# EasyEDA Pro project compute-module-v101.eprj, board base-board-6x
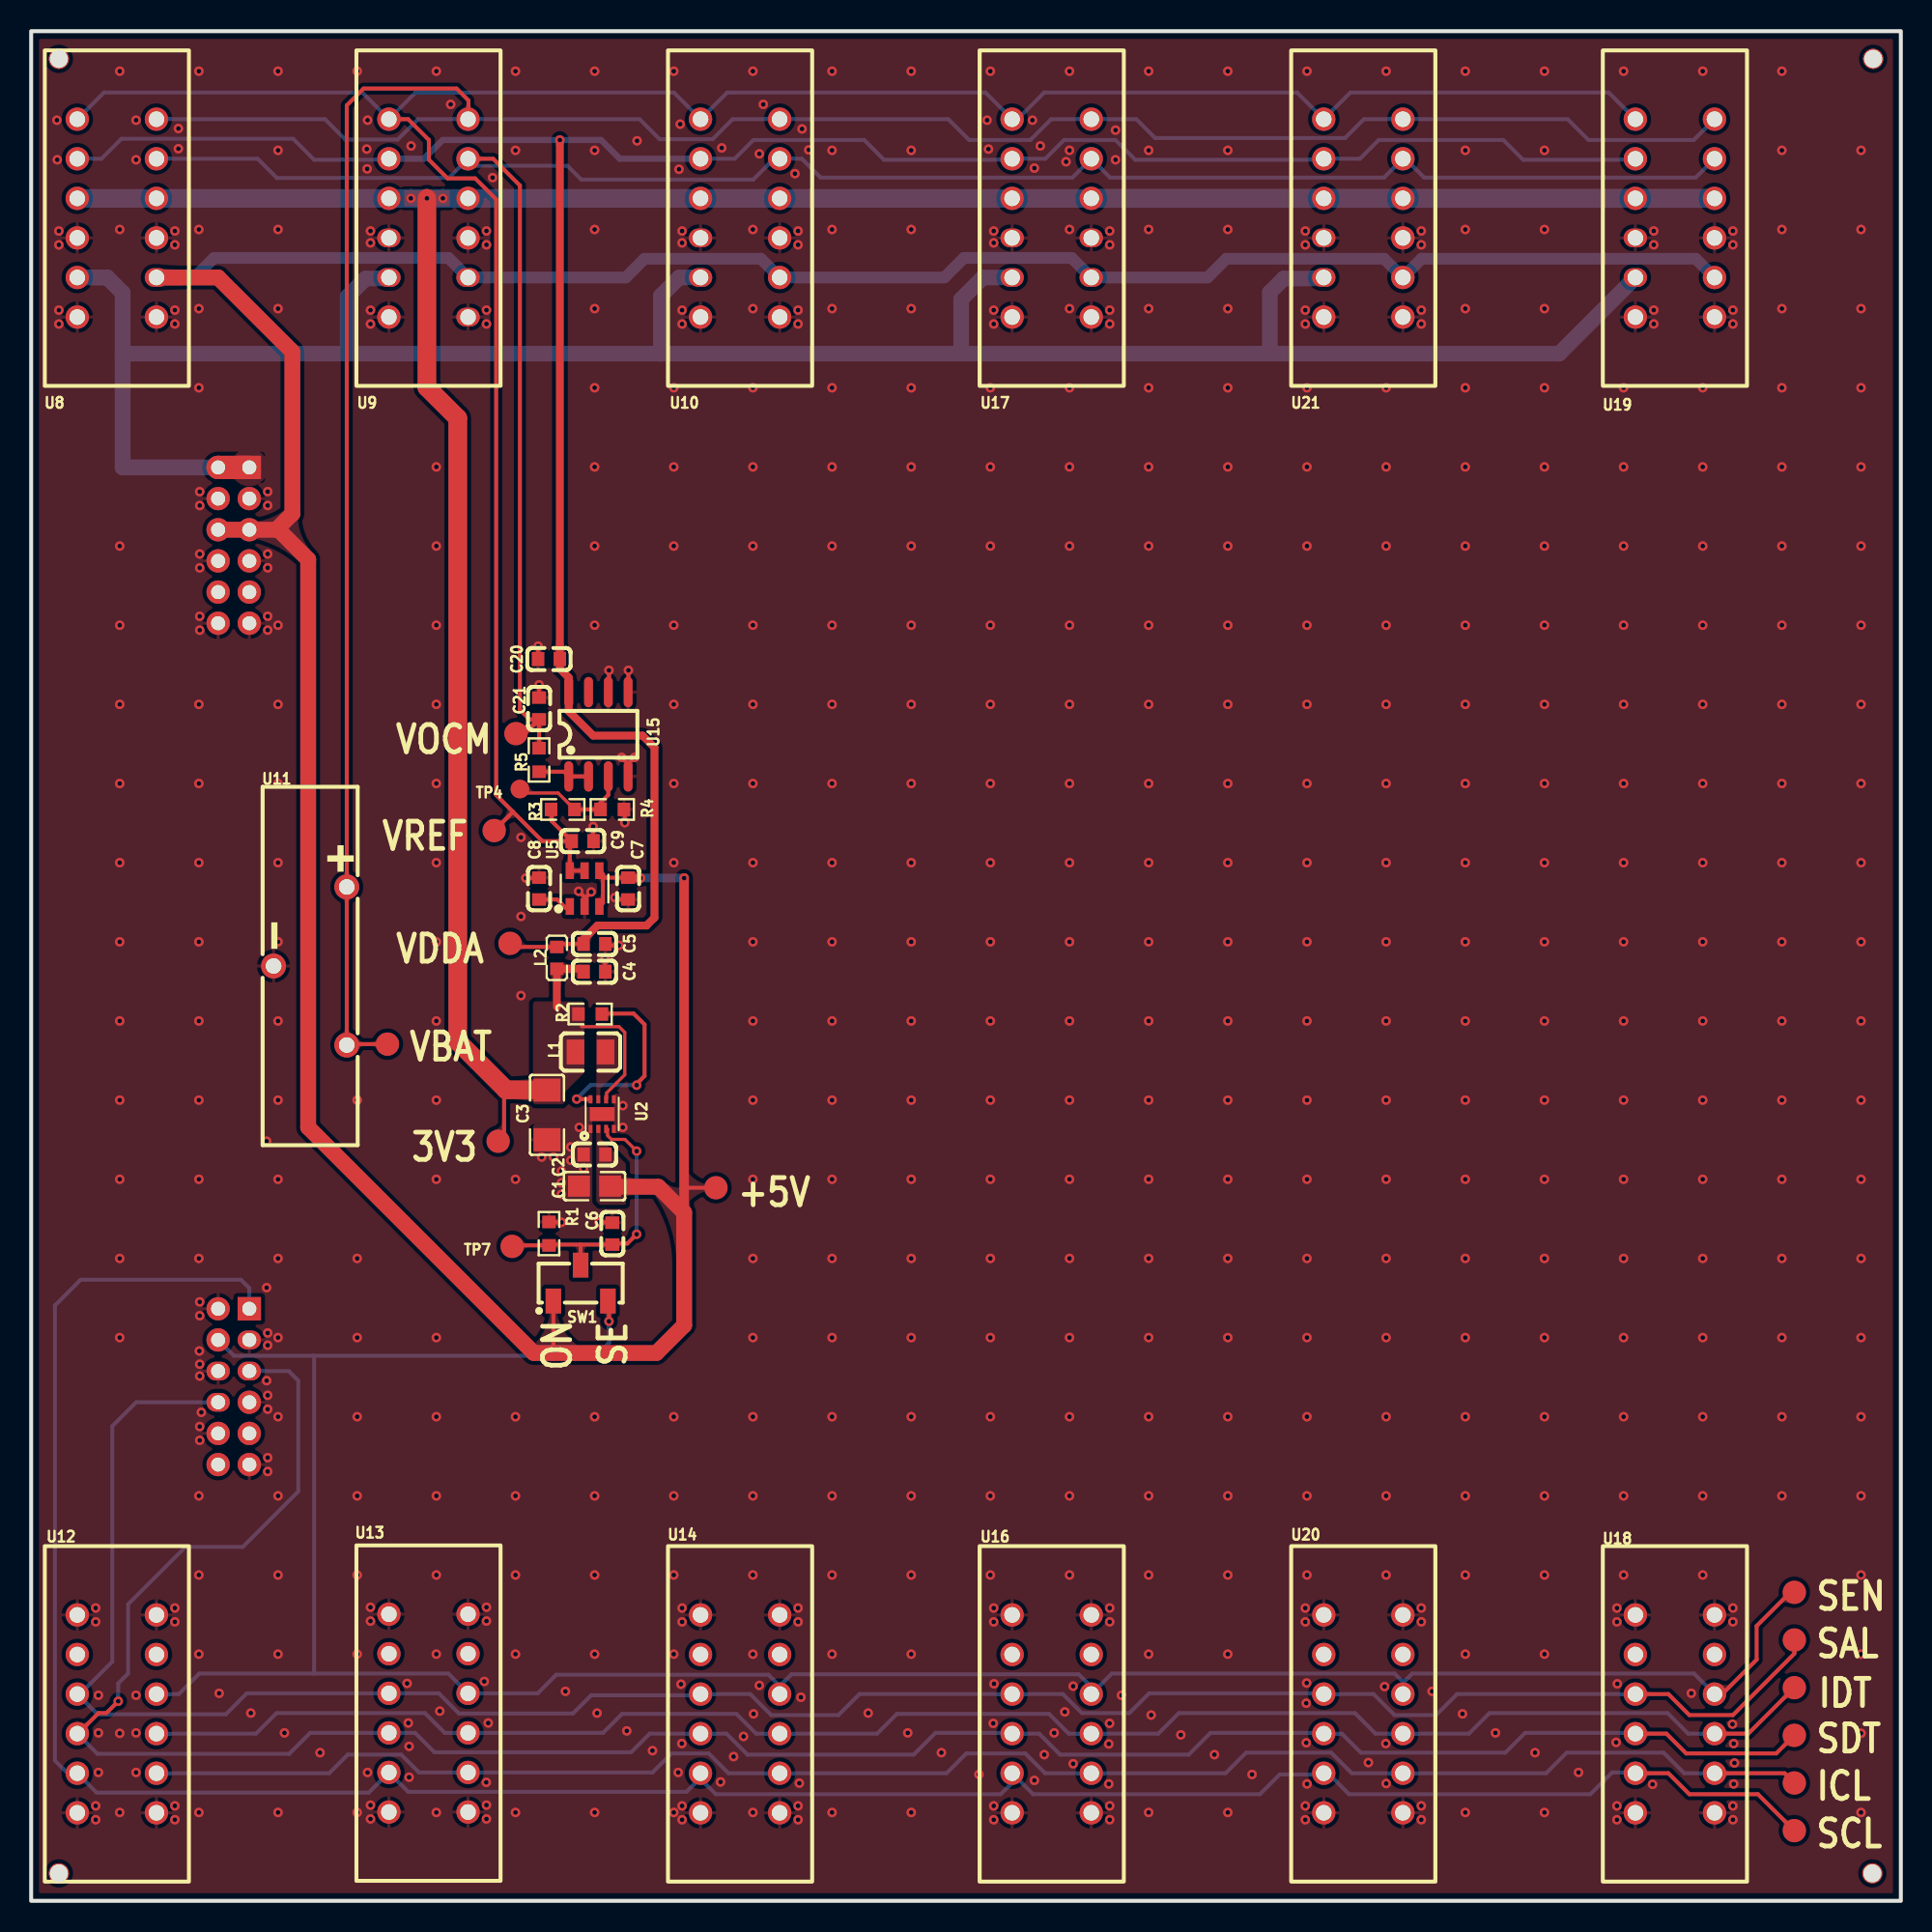
[diagram p16: board, top side]
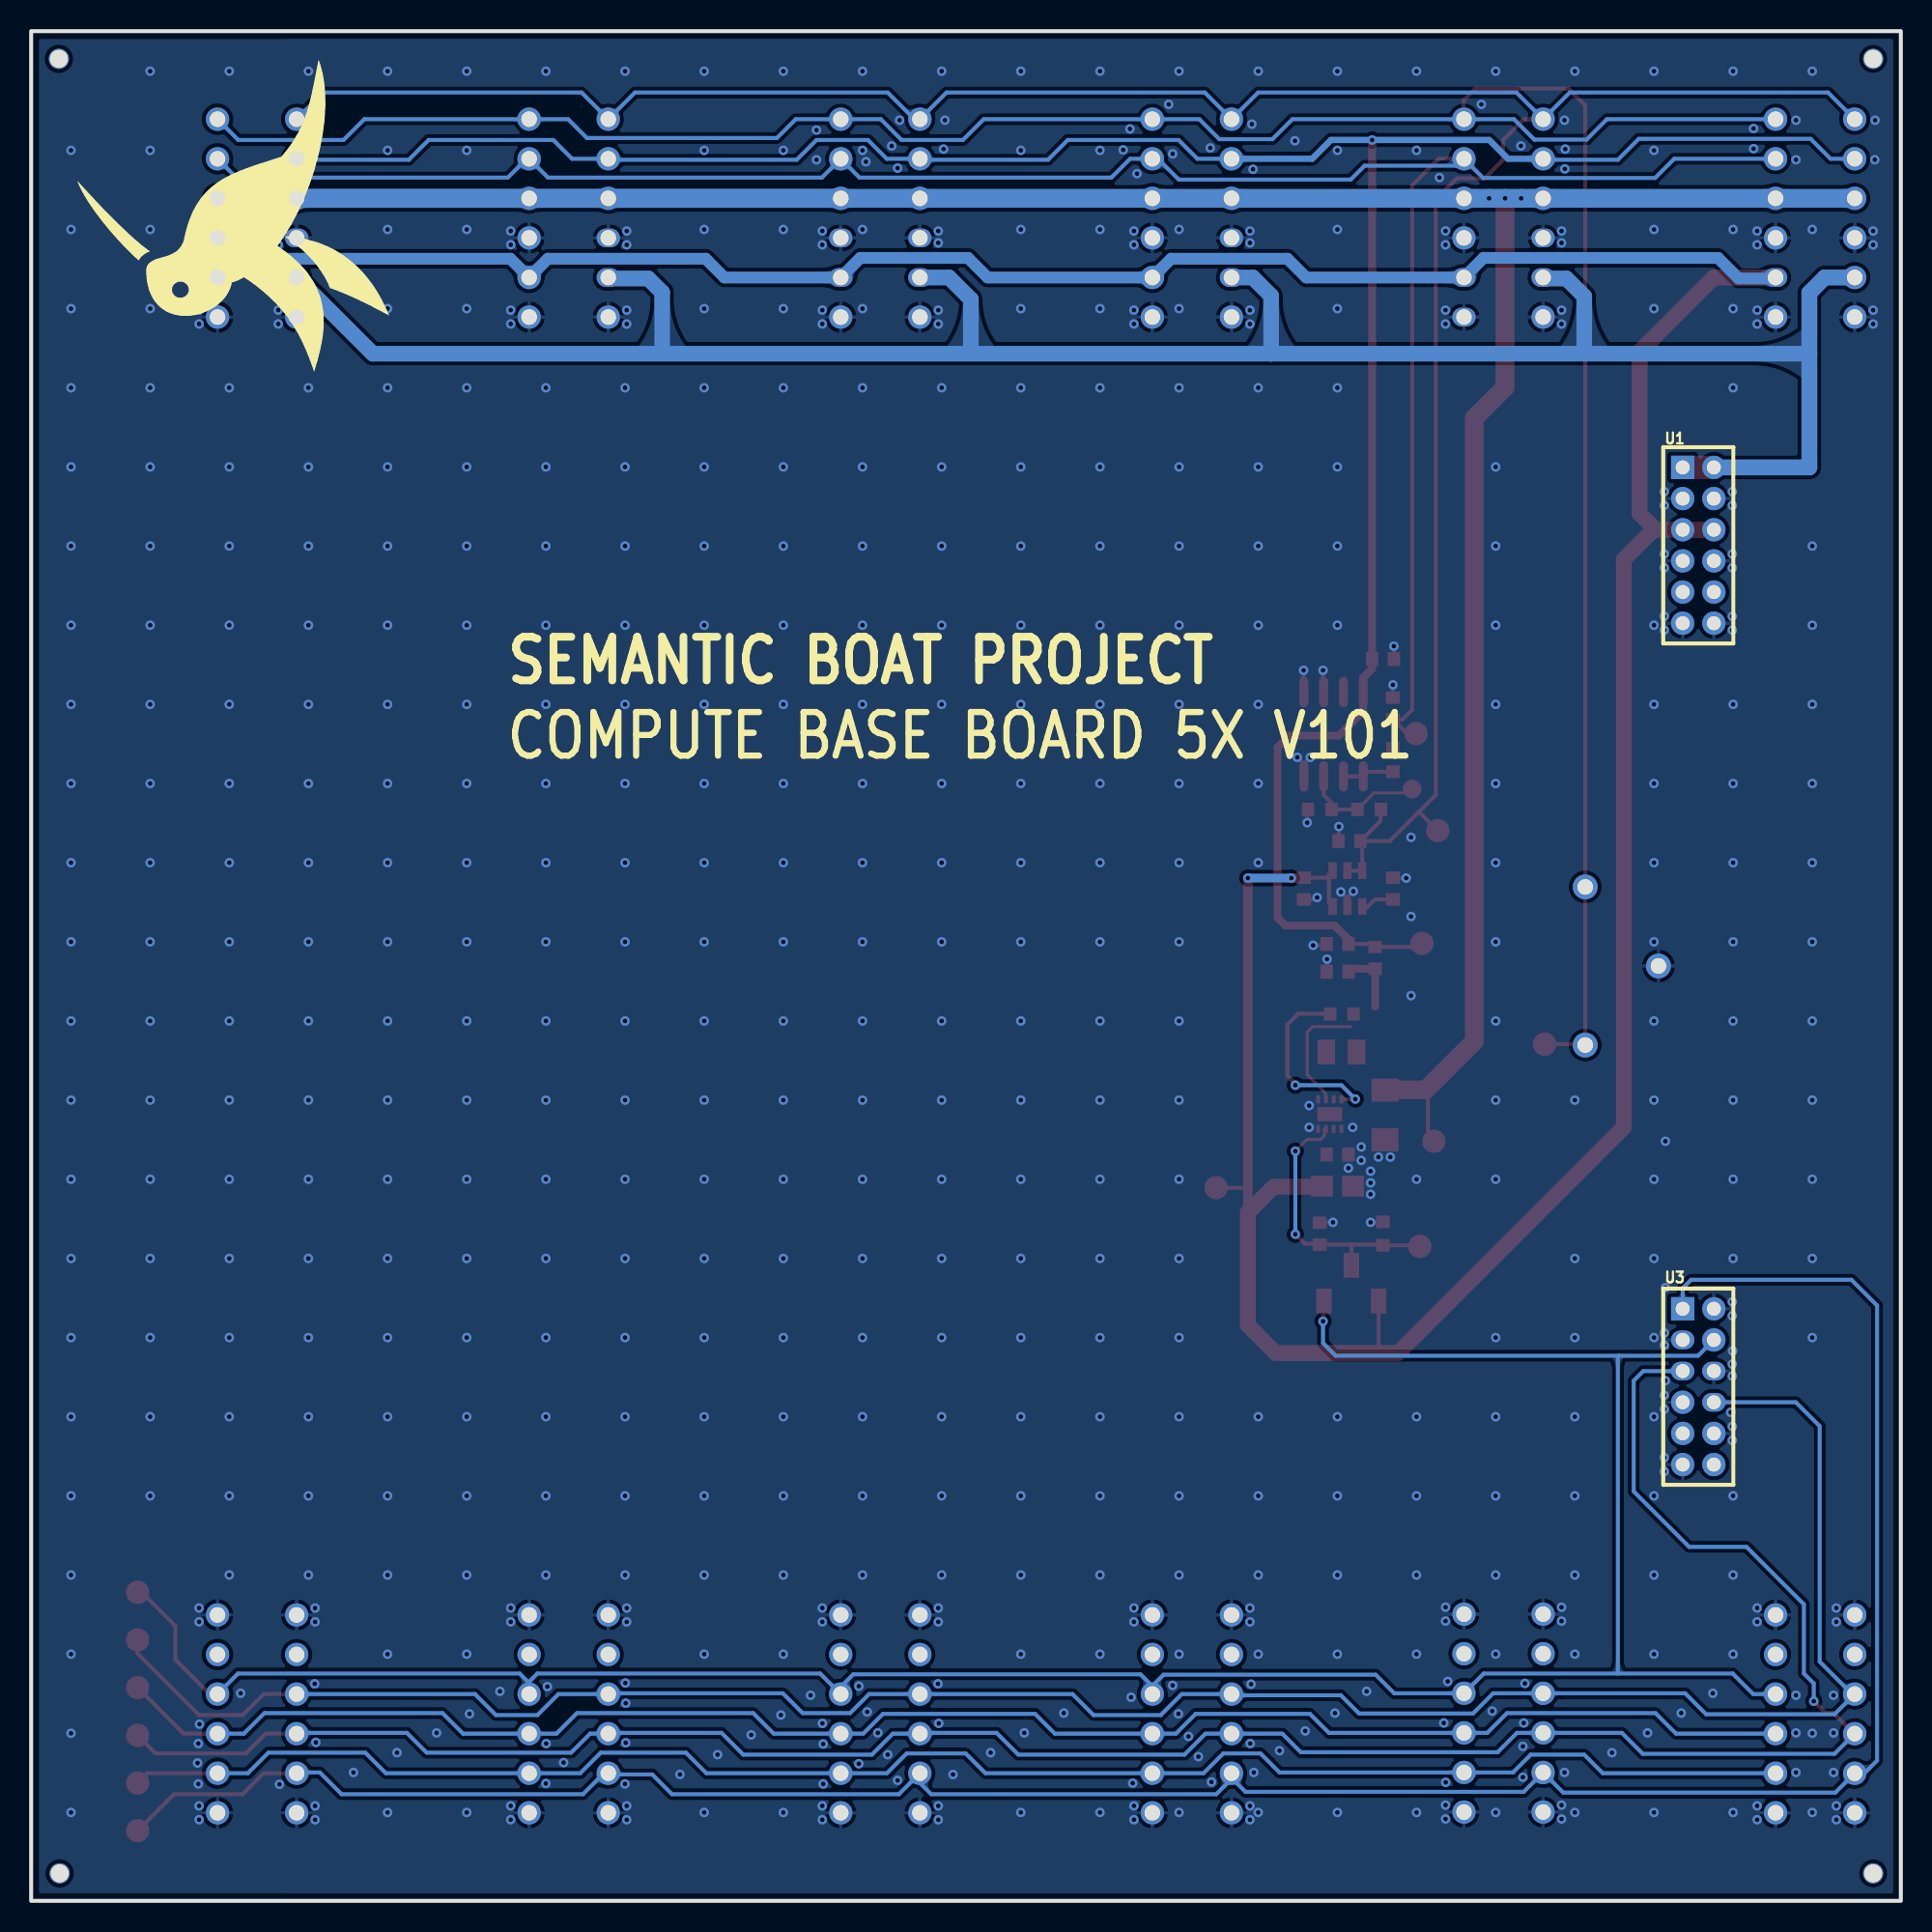
[diagram p17: board, bottom side, seen from below]

Outline 120 x 120 mm; copper layers: Top Layer, Inner1, Inner2, Bottom Layer. Coordinates in mm from the lower left corner of the outline.
Outline path: rectangle 0,120 120,0
Stack: Top Layer 0.035mm Outer layer thickness 1oz / Dielectric1 0.2104mm 7628 RC49% 8.6mil / Inner1 0.0152mm Inner layer thickness / Dielectric2 1.065mm 1.1mm H/HOZ Copper / Inner2 0.0152mm Inner layer thickness / Dielectric3 0.2104mm 7628 RC49% 8.6mil / Bottom Layer 0.035mm Outer layer thickness 1oz

## Design rules (mm)
template: JLCPCB Capability(Two Layers Board)
spacing copperThickness1oz (default): track to track 0.102, other pairs 0.152 to 0.3
spacing copperThickness2oz: track to track 0.203, other pairs 0.152 to 0.3
track width copperThickness1oz (default): min 0.127, default 0.254, max 2.54
track width copperThickness2oz: min 0.203, default 0.254, max 2.54
differential pair differentialPair (default): width min 0.127, default 0.254, max 2.54; gap min 0.152, default 0.152
via viaSize (default): diameter min 0.5, default 0.61, max 10; hole min 0.3, default 0.305, max 6.3

## Placement (name value [footprint] x y rotation side)
C1  10uF  [C0805]  36.16 45.87 180 top
C2  100nF  [C0603]  36.16 47.9 180 top
C3  22uF  [C1206]  33.11 50.44 270 top
C4  100nF  [C0603]  36.15 59.63 180 top
C5  100nF  [C0603]  36.15 61.41 180 top
C6  100nF  [C0603]  37.3 42.82 90 top
C7  100nF  [C0603]  38.31 64.97 270 top
C8  100nF  [C0603]  32.6 64.97 90 top
C9  100nF  [C0603]  35.39 68.02 0 top
C20  100nF  [C0603]  33.23 79.7 180 top
C21  2.2uF  [C0603]  32.6 76.53 90 top
L1  2.2uH  [IND-SMD_L2.0-W1.6-1]  35.9 54.48 180 top
L2  BLM18KG601SN1D  [L0603]  33.74 60.52 90 top
NOREF  -  [Pad_e13857]  118.17 1.76 90 top
NOREF#2  -  [Pad_e13859]  1.78 118.22 270 top
NOREF#3  -  [Pad_e13856]  1.78 1.76 0 top
NOREF#4  -  [Pad_e13858]  118.22 118.22 180 top
R1  100kΩ  [R0603]  33.24 42.82 90 top
R2  100kΩ  [R0603]  35.88 56.92 180 top
R3  10kΩ  [R0603]  34.12 70.05 0 top
R4  10kΩ  [R0603]  37.3 70.05 0 top
R5  10Ω  [R0603]  32.6 73.22 90 top
SW1  CAS-120A  [SW-SMD_CAS-120A]  35.27 39.65 0 top
TP1  -  [Test-Point-0.5mm]  29.72 68.69 0 top
TP2  -  [Test-Point-0.5mm]  43.95 45.77 0 top
TP3  -  [Test-Point-0.5mm]  31.11 74.92 0 top
TP4  -  [Test-Point-0.5mm#2]  31.37 71.36 0 top
TP5  -  [Test-Point-0.5mm]  29.97 48.75 0 top
TP6  -  [Test-Point-0.5mm]  30.73 61.45 0 top
TP7  -  [Test-Point-0.5mm]  30.87 42 0 top
TP8  -  [Test-Point-0.5mm]  113.17 19.8 0 top
TP9  -  [Test-Point-0.5mm]  113.17 16.74 0 top
TP10  -  [Test-Point-0.5mm]  113.17 4.5 0 top
TP11  -  [Test-Point-0.5mm]  113.17 10.62 0 top
TP13  -  [Test-Point-0.5mm]  22.87 54.99 0 top
TP14  -  [Test-Point-0.5mm]  113.17 7.56 0 top
TP15  -  [Test-Point-0.5mm]  113.17 13.68 0 top
U1  2005FV-2x6P  [HDR-TH_12P-P2.00-V-F-R2-C6-S2.00]  13 87 270 bottom
U2  TPS62162DSGR  [WSON-8_L2.0-W2.0-P0.50-TL-EP]  36.65 50.49 90 top
U3  2005FV-2x6P  [HDR-TH_12P-P2.00-V-F-R2-C6-S2.00#2]  13 33 270 bottom
U5  ZJR1001-3BUTBR  [SOT-23-6_L2.9-W1.6-P0.95-LS2.9-BL]  35.52 64.97 0 top
U8  ED12BGFBK  [CONN-TH_12P-P2.54_WINGTAT_ED12BGFBK#2]  5.5 108 90 top
U9  ED12BGFBK  [CONN-TH_12P-P2.54_WINGTAT_ED12BGFBK#3]  25.5 108 90 top
U10  ED12BGFBK  [CONN-TH_12P-P2.54_WINGTAT_ED12BGFBK#4]  45.5 108 90 top
U11  VBH2032-1  [BAT-TH_3P-L23.0-W6.0_VBH2032-1]  17.91 60 270 top
U12  ED12BGFBK  [CONN-TH_12P-P2.54_WINGTAT_ED12BGFBK#5]  5.5 12 90 top
U13  ED12BGFBK  [CONN-TH_12P-P2.54_WINGTAT_ED12BGFBK#5]  25.5 12.05 90 top
U14  ED12BGFBK  [CONN-TH_12P-P2.54_WINGTAT_ED12BGFBK#5]  45.5 12 90 top
U15  TLV9062IDR  [SOIC-8_L5.0-W4.0-P1.27-LS6.0-BL]  36.41 74.87 0 top
U16  ED12BGFBK  [CONN-TH_12P-P2.54_WINGTAT_ED12BGFBK#5]  65.5 12 90 top
U17  ED12BGFBK  [CONN-TH_12P-P2.54_WINGTAT_ED12BGFBK]  65.5 108 90 top
U18  ED12BGFBK  [CONN-TH_12P-P2.54_WINGTAT_ED12BGFBK#5]  105.5 12 90 top
U19  ED12BGFBK  [CONN-TH_12P-P2.54_WINGTAT_ED12BGFBK#4]  105.5 108 90 top
U20  ED12BGFBK  [CONN-TH_12P-P2.54_WINGTAT_ED12BGFBK#5]  85.5 12 90 top
U21  ED12BGFBK  [CONN-TH_12P-P2.54_WINGTAT_ED12BGFBK#4]  85.5 108 90 top

## Footprints (pads in the part's own frame, mm; a bottom-side part is the same pattern mirrored in y, then rotated)
BAT-TH_3P-L23.0-W6.0_VBH2032-1
  round 1.6 hole 1: 1(-5.075,2.35) 2(5.075,2.35) 3(0,-2.35)
C0603
  rect 0.8x0.9 smd: 1(-0.7,0) 2(0.7,0)
C0805
  rect 1.41x1.35 smd: 1(-1,0) 2(1,0)
C1206
  rect 1.485x1.728 smd: 1(-1.593,0) 2(1.593,0)
CONN-TH_12P-P2.54_WINGTAT_ED12BGFBK
  round 1.5 hole 1: 1(-6.35,2.54) 4(1.27,2.54) 5(3.81,2.54) 6(6.35,2.54) 7(6.35,-2.54) 8(3.81,-2.54) 9(1.27,-2.54) 12(-6.35,-2.54)
  oval 1.2x1.5 hole 1: 2(-3.81,2.54) 3(-1.27,2.54) 10(-1.27,-2.54) 11(-3.81,-2.54)
CONN-TH_12P-P2.54_WINGTAT_ED12BGFBK#2
  round 1.5 hole 1: 1(-6.35,2.54) 2(-3.81,2.54) 3(-1.27,2.54) 4(1.27,2.54) 5(3.81,2.54) 6(6.35,2.54) 7(6.35,-2.54) 8(3.81,-2.54) 9(1.27,-2.54) 10(-1.27,-2.54) 12(-6.35,-2.54)
  oval 1.2x1.5 hole 1: 11(-3.81,-2.54)
CONN-TH_12P-P2.54_WINGTAT_ED12BGFBK#3
  round 1.5 hole 1: 1(-6.35,2.54) 4(1.27,2.54) 5(3.81,2.54) 6(6.35,2.54) 7(6.35,-2.54) 8(3.81,-2.54) 9(1.27,-2.54) 10(-1.27,-2.54)
  oval 1.2x1.5 hole 1: 2(-3.81,2.54) 3(-1.27,2.54) 11(-3.81,-2.54) 12(-6.35,-2.54)
CONN-TH_12P-P2.54_WINGTAT_ED12BGFBK#4
  round 1.5 hole 1: 1(-6.35,2.54) 4(1.27,2.54) 5(3.81,2.54) 6(6.35,2.54) 7(6.35,-2.54) 8(3.81,-2.54) 9(1.27,-2.54) 10(-1.27,-2.54) 11(-3.81,-2.54) 12(-6.35,-2.54)
  oval 1.2x1.5 hole 1: 2(-3.81,2.54) 3(-1.27,2.54)
CONN-TH_12P-P2.54_WINGTAT_ED12BGFBK#5
  round 1.5 hole 1: 1(-6.35,2.54) 2(-3.81,2.54) 3(-1.27,2.54) 4(1.27,2.54) 5(3.81,2.54) 6(6.35,2.54) 7(6.35,-2.54) 8(3.81,-2.54) 9(1.27,-2.54) 10(-1.27,-2.54) 11(-3.81,-2.54) 12(-6.35,-2.54)
HDR-TH_12P-P2.00-V-F-R2-C6-S2.00
  rect 1.5x1.5 hole 0.9: 1(-5,-1)
  round 1.5 hole 0.9: 2(-5,1) 3(-3,-1) 4(-3,1) 5(-1,-1) 6(-1,1) 7(1,-1) 8(1,1) 9(3,-1) 10(3,1) 11(5,-1) 12(5,1)
HDR-TH_12P-P2.00-V-F-R2-C6-S2.00#2
  rect 1.5x1.5 hole 0.9: 1(-5,-1)
  round 1.5 hole 0.9: 2(-5,1) 4(-3,1) 7(1,-1) 9(3,-1) 10(3,1) 11(5,-1) 12(5,1)
  oval 1.2x1.5 hole 0.9: 3(-3,-1) 5(-1,-1) 6(-1,1) 8(1,1)
IND-SMD_L2.0-W1.6-1
  rect 1.133x1.6 smd: 1(-0.967,0) 2(0.967,0)
L0603
  rect 0.8x0.864 smd: 1(-0.7,0) 2(0.7,0)
Pad_e13856
  round 1.3 hole 1.152: 1(0,0)
Pad_e13857
  round 1.3 hole 1.152: 1(0,0)
Pad_e13858
  round 1.3 hole 1.152: 1(0,0)
Pad_e13859
  round 1.3 hole 1.152: 1(0,0)
R0603
  rect 0.806x0.864 smd: 1(-0.753,0) 2(0.753,0)
SOIC-8_L5.0-W4.0-P1.27-LS6.0-BL
  oval 0.569x1.95 smd: 1(-1.905,-2.705) 2(-0.635,-2.705) 3(0.635,-2.705) 4(1.905,-2.705) 5(1.905,2.705) 6(0.635,2.705) 7(-0.635,2.705) 8(-1.905,2.705)
SOT-23-6_L2.9-W1.6-P0.95-LS2.9-BL
  rect 0.532x1.072 smd: 1(-0.95,-1.149) 2(0,-1.149) 3(0.95,-1.149) 4(0.95,1.149) 5(0,1.149) 6(-0.95,1.149)
SW-SMD_CAS-120A
  rect 1x1.6 smd: 1(-1.75,-1.15) 2(0,1.15) 3(1.75,-1.15)
Test-Point-0.5mm
  round 1.5 smd: 1(0,0)
Test-Point-0.5mm#2
  round 1.2 smd: 1(0,0)
WSON-8_L2.0-W2.0-P0.50-TL-EP
  rect 0.521x0.25 smd: 1(-0.95,0.75) 2(-0.95,0.25) 3(-0.95,-0.25) 4(-0.95,-0.75) 5(0.95,-0.75) 6(0.95,-0.25) 7(0.95,0.25) 8(0.95,0.75)
  rect 0.9x1.6 smd: 9(0,0)

## Nets
As in the schematic.

Pads without a net: NOREF 1; NOREF#2 1; NOREF#3 1; NOREF#4 1; U1 9 10; U3 9 12; U12 5 8; U13 5 8; U14 5 8; U15 7; U16 5 8; U18 5 8; U20 5 8

## Via types
v1: diameter 0.61, hole 0.305, Top Layer to Bottom Layer, 679 vias

## Routing (per net, layer and track width the routed paths; a pad name or vN(x,y) marks a point on that pad's centre or on a via; arc(x,y) is an arc through that point)
+3V3: length 182.2
  Top Layer w0.2: U2.6 36.9,51.49 36.93,51.52 36.93,51.85 37.55,52.47 37.55,52.47 38.1,53.02 38.1,55.74 37.73,56.11 35.32,56.11
  Top Layer w0.254: TP5.1 30.35,49.13 30.35,51.8
  Top Layer w0.5: C4.2 35.27,59.82 L2.1 33.74,57.39
  Top Layer w1.2: v1(25.4,109.27) 25.4,97.14 27.38,95.16 27.38,55.16 30.48,52.06 33.09,52.06 C3.1
  Bottom Layer w1.2: U17.9 U17.4 U10.9 U10.4 U9.9 v1(26.43,109.27) v1(25.4,109.27) v1(24.37,109.27) U9.4 U8.9 U8.4
  Bottom Layer w1.219: U19.9 U19.4 U21.9 U21.4 U17.9
+5V: length 248.8
  Top Layer w0.254: 36.47,66.12 36.7,65.88 36.7,65.64 ; 36.47,63.82 36.7,64.05 36.7,65.64 ; SW1.1 33.52,35.18 33.5,35.16 ; 36.7,65.64 36.73,65.67 C7.1 ; 41.78,45.7 41.85,45.77 TP2.1
  Top Layer w0.559: v1(39.12,65.64) 38.34,65.64 C7.1
  Top Layer w0.61: v1(41.91,65.64) 41.91,44.17
  Top Layer w1.016: U8.11 12,104.19 16.76,99.43 16.76,89.03 15.73,88 U1.5 U1.6 ; C1.1 37.2,45.83 40.25,45.83 41.91,44.17 41.91,36.94 40.13,35.16 32.26,35.16 17.78,49.64 17.78,86.09 15.88,88
  Bottom Layer w0.559: v1(41.91,65.64) v1(39.12,65.64)
  Bottom Layer w0.75: U19.11 106.84,105.39 89.25,105.39 U21.11 86.84,105.39 76.71,105.39 75.5,104.19 U17.11 66.78,105.45 59.87,105.45 58.61,104.19 U10.11 46.84,105.39 39.37,105.39 38.16,104.19 U9.11 26.78,105.45 11.73,105.45 10.41,104.12 8.11,104.12 U8.11
+12V: length 150.2
  Top Layer w1.5: U1.2 U1.1
  Bottom Layer w1: 59.69,99.43 59.69,102.79 61.09,104.19 U17.2 ; 20.32,99.3 40.42,99.3 ; 20.32,99.3 5.9,99.3 5.87,99.27 ; 20.32,99.3 20.32,102.98 21.46,104.12 22.89,104.12 U9.2 ; 40.42,99.3 40.42,99.3 40.42,103.01 41.59,104.19 U10.2 ; 40.42,99.3 98.07,99.3 U19.2 ; U21.2 82.9,104.12 80.39,104.12 79.5,103.24 79.5,99.43
  Bottom Layer w1.016: U1.2 5.87,92 5.87,103.21 4.89,104.19 U8.2
GND: length 15.2
  Top Layer w0.254: R4.2 38.1,70 v1(38.1,69.2) ; R1.2 33.27,43.55 v1(34.04,43.55) ; 38.31,72.97 U15.4 ; 38.31,72.97 v1(38.74,73.39) ; 38.31,72.97 38.31,72.97 v1(37.9,73.39) ; 35.52,64.33 U5.2 ; 35.52,64.33 v1(35.94,64.75) ; 35.52,64.33 35.52,64.42 v1(35.14,64.8) ; v1(32.54,80.53) 32.54,79.7 C20.2 ; v1(36.07,68.95) 36.07,68.04 C9.2 ; C7.2 37.59,64.27 v1(37.47,64.39) ; v1(37.72,61.33) 36.94,61.33 C5.1 ; U15.6 37.08,77.62 v1(37.08,78.98) ; v1(31.75,65.64) 32.57,65.64 C8.2 ; v1(36.83,60.44) 36.83,59.66 C4.1 ; v1(32.6,78.05) 32.6,77.22 ; v1(36.45,43.55) 37.28,43.55 C6.2 ; U15.5 38.33,77.6 v1(38.33,78.98)
  vias: v1(1.65,114.28) v1(1.68,111.75) v1(1.78,107.17) v1(1.78,106.28) v1(1.78,102.09) v1(1.78,101.2) v1(4.14,18.8) v1(4.14,17.91) v1(4.14,6.1) v1(4.14,5.21) v1(4.32,13.19) v1(4.32,10.78) v1(4.32,8.24) v1(5.68,117.43) v1(5.68,107.27) v1(5.68,86.95) v1(5.68,81.87) v1(5.68,76.79) v1(5.68,71.71) v1(5.68,66.63) v1(5.68,61.55) v1(5.68,56.47) v1(5.68,51.39) v1(5.68,46.31) v1(5.68,41.23) v1(5.68,36.15) v1(5.68,10.75) v1(5.68,5.67) v1(6.73,114.28) v1(6.73,111.75) v1(6.73,13.19) v1(6.73,10.78) v1(6.73,8.24) v1(9.22,107.18) v1(9.22,106.29) v1(9.22,102.1) v1(9.22,101.21) v1(9.22,18.8) v1(9.22,17.91) v1(9.22,6.1) v1(9.22,5.21) v1(9.45,113.75) v1(9.45,112.46) v1(10.76,117.43) v1(10.76,107.27) v1(10.76,102.19) v1(10.76,97.11) v1(10.82,90.44) v1(10.82,89.55) v1(10.82,86.44) v1(10.82,85.55) v1(10.82,82.44) v1(10.82,81.55) v1(10.76,76.79) v1(10.76,71.71) v1(10.76,66.63) v1(10.76,61.55) v1(10.76,56.47) v1(10.76,51.39) v1(10.76,46.31) v1(10.76,41.23) v1(10.82,38.44) v1(10.82,37.55) v1(10.8,35.29) v1(10.82,34.44) v1(10.82,33.68) v1(10.82,30.44) v1(10.82,29.55) v1(10.76,25.99) v1(10.76,20.91) v1(10.76,15.83) v1(10.76,5.67) v1(10.92,31.35) v1(12.06,13.32) v1(14.1,12.05) v1(15.11,48.75) v1(15.11,39.35) v1(15.11,33.39) v1(15.18,90.45) v1(15.18,89.56) v1(15.18,86.45) v1(15.18,85.56) v1(15.18,82.45) v1(15.18,81.56) v1(15.18,36.45) v1(15.18,35.66) v1(15.18,32.45) v1(15.18,31.56) v1(15.18,28.45) v1(15.18,27.56) v1(15.84,117.43) v1(15.84,112.35) v1(15.84,107.27) v1(15.84,102.19) v1(15.84,81.87) v1(15.84,76.79) v1(15.84,71.71) v1(15.84,66.63) v1(15.84,61.55) v1(15.84,56.47) v1(15.84,51.39) v1(15.84,46.31) v1(15.84,41.23) v1(15.84,36.15) v1(15.84,31.07) v1(15.84,25.99) v1(15.84,20.91) v1(15.84,15.83) v1(15.84,5.67) v1(16.26,10.78) v1(18.54,9.51) v1(20.92,117.43) v1(20.92,51.39) v1(20.92,41.23) v1(20.92,36.15) v1(20.92,31.07) v1(20.92,25.99) v1(20.92,20.91) v1(20.92,15.83) v1(20.92,5.67) v1(21.54,112.43) v1(21.59,114.28) v1(21.56,111.16) v1(21.59,8.24) v1(21.78,107.17) v1(21.78,106.41) v1(21.78,102.09) v1(21.78,101.2) v1(21.78,18.84) v1(21.78,17.95) v1(21.78,6.14) v1(21.78,5.25) v1(24.13,13.96) v1(24.21,11.41) v1(24.26,9.92) v1(24.26,7.94) v1(24.38,112.63) v1(26,117.43) v1(26,92.03) v1(26,86.95) v1(26,81.87) v1(26,76.79) v1(26,71.71) v1(26,66.63) v1(26,61.55) v1(26,56.47) v1(26,51.39) v1(26,46.31) v1(26,36.15) v1(26,31.07) v1(26,25.99) v1(26,20.91) v1(26,15.83) v1(26,5.67) v1(26.23,12.18) v1(26.92,115.3) v1(29.08,14.08) v1(29.22,107.18) v1(29.22,106.29) v1(29.22,102.1) v1(29.22,101.21) v1(29.22,18.85) v1(29.22,17.96) v1(29.21,7.6) v1(29.22,6.15) v1(29.22,5.26) v1(29.34,11.41) v1(29.62,110.6) v1(31.08,117.43) v1(31.08,112.35) v1(31.08,46.31) v1(31.08,31.07) v1(31.08,25.99) v1(31.08,20.91) v1(31.08,15.83) v1(31.08,5.67) v1(31.44,68.26) v1(31.44,63.18) v1(31.44,58.1) v1(32.77,47.74) v1(33.53,47.74) v1(34.04,46.83) v1(34.04,46.08) v1(34.04,45.35) v1(34.29,13.45) v1(34.63,48.38) v1(34.63,47.52) v1(35.18,49.64) v1(35.46,47.03) v1(36.16,117.43) v1(36.16,112.35) v1(36.16,107.27) v1(36.16,102.19) v1(36.16,97.11) v1(36.16,92.03) v1(36.16,86.95) v1(36.16,81.87) v1(36.16,31.07) v1(36.16,25.99) v1(36.16,20.91) v1(36.16,15.83) v1(36.16,5.67) v1(36.32,12.05) v1(37.97,51.04) v1(37.97,49.64) v1(38.23,10.91) v1(38.89,112.96) v1(39.88,9.64) v1(41.24,117.43) v1(41.24,97.11) v1(41.24,92.03) v1(41.24,86.95) v1(41.24,81.87) v1(41.24,76.79) v1(41.24,71.71) v1(41.24,66.63) v1(41.24,31.07) v1(41.24,25.99) v1(41.24,20.91) v1(41.24,15.83) v1(41.24,5.67) v1(41.53,8.24) v1(41.58,111.14) v1(41.66,114.03) v1(41.71,13.9) v1(41.78,107.17) v1(41.78,106.41) v1(41.78,102.09) v1(41.78,101.2) v1(41.78,18.79) v1(41.78,17.9) v1(41.76,10.09) v1(41.78,6.09) v1(41.78,5.2) v1(44.25,7.63) v1(44.32,112.51) v1(45.09,9.26) v1(45.72,10.55) v1(46.32,117.43) v1(46.32,107.27) v1(46.32,102.19) v1(46.32,97.11) v1(46.32,92.03) v1(46.32,86.95) v1(46.32,81.87) v1(46.32,76.79) v1(46.32,71.71) v1(46.32,66.63) v1(46.32,61.55) v1(46.32,56.47) v1(46.32,51.39) v1(46.32,46.31) v1(46.32,41.23) v1(46.32,36.15) v1(46.32,31.07) v1(46.32,25.99) v1(46.32,20.91) v1(46.32,15.83) v1(46.32,5.67) v1(46.37,12) v1(46.74,112.13) v1(46.74,13.83) v1(46.99,115.3) v1(49.02,110.86) v1(49.22,107.18) v1(49.22,106.29) v1(49.22,102.1) v1(49.22,101.21) v1(49.22,18.8) v1(49.22,17.91) v1(49.22,6.1) v1(49.22,5.21) v1(49.3,7.55) v1(49.4,13.07) v1(49.48,113.73) v1(49.91,112.38) v1(51.4,117.43) v1(51.4,112.35) v1(51.4,107.27) v1(51.4,102.19) v1(51.4,97.11) v1(51.4,92.03) v1(51.4,86.95) v1(51.4,81.87) v1(51.4,76.79) v1(51.4,71.71) v1(51.4,66.63) v1(51.4,61.55) v1(51.4,56.47) v1(51.4,51.39) v1(51.4,46.31) v1(51.4,41.23) v1(51.4,36.15) v1(51.4,31.07) v1(51.4,25.99) v1(51.4,20.91) v1(51.4,15.83) v1(51.4,5.67) v1(53.72,12.05) v1(56.26,10.78) v1(56.48,117.43) v1(56.48,112.35) v1(56.48,107.27) v1(56.48,102.19) v1(56.48,97.11) v1(56.48,92.03) v1(56.48,86.95) v1(56.48,81.87) v1(56.48,76.79) v1(56.48,71.71) v1(56.48,66.63) v1(56.48,61.55) v1(56.48,56.47) v1(56.48,51.39) v1(56.48,46.31) v1(56.48,41.23) v1(56.48,36.15) v1(56.48,31.07) v1(56.48,25.99) v1(56.48,20.91) v1(56.48,15.83) v1(56.48,5.67) v1(58.42,9.51) v1(60.83,8.11) v1(61.35,114.28) v1(61.44,112.43) v1(61.56,117.43) v1(61.56,97.11) v1(61.56,92.03) v1(61.56,86.95) v1(61.56,81.87) v1(61.56,76.79) v1(61.56,71.71) v1(61.56,66.63) v1(61.56,61.55) v1(61.56,56.47) v1(61.56,51.39) v1(61.56,46.31) v1(61.56,41.23) v1(61.56,36.15) v1(61.56,31.07) v1(61.56,25.99) v1(61.56,20.91) v1(61.75,11.39) v1(61.78,107.17) v1(61.78,106.41) v1(61.78,102.09) v1(61.78,101.2) v1(61.78,18.79) v1(61.78,17.9) v1(61.8,13.93) v1(61.78,6.09) v1(61.78,5.2) v1(64.26,114.28) v1(64.39,111.21) v1(64.39,7.73) v1(64.77,112.63) v1(65.02,9.38) v1(65.66,10.78) v1(66.34,12.13) v1(66.42,111.62) v1(66.64,117.43) v1(66.64,112.35) v1(66.64,107.27) v1(66.64,102.19) v1(66.64,97.11) v1(66.64,92.03) v1(66.64,86.95) v1(66.64,81.87) v1(66.64,76.79) v1(66.64,71.71) v1(66.64,66.63) v1(66.64,61.55) v1(66.64,56.47) v1(66.64,51.39) v1(66.64,46.31) v1(66.64,41.23) v1(66.64,36.15) v1(66.64,31.07) v1(66.64,25.99) v1(66.64,20.91) v1(66.88,13.78) v1(66.88,8.8) v1(69.22,107.18) v1(69.22,106.29) v1(69.22,102.1) v1(69.22,101.21) v1(69.22,18.8) v1(69.22,17.91) v1(69.22,11.39) v1(69.16,10.07) v1(69.16,7.5) v1(69.22,6.1) v1(69.22,5.21) v1(69.6,113.65) v1(69.6,111.75) v1(69.98,13.19) v1(71.72,117.43) v1(71.72,112.35) v1(71.72,107.27) v1(71.72,102.19) v1(71.72,97.11) v1(71.72,92.03) v1(71.72,86.95) v1(71.72,81.87) v1(71.72,76.79) v1(71.72,71.71) v1(71.72,66.63) v1(71.72,61.55) v1(71.72,56.47) v1(71.72,51.39) v1(71.72,46.31) v1(71.72,41.23) v1(71.72,36.15) v1(71.72,31.07) v1(71.72,25.99) v1(71.72,20.91) v1(71.72,15.83) v1(71.72,5.67) v1(71.88,11.92) v1(73.79,10.65) v1(75.95,9.38) v1(76.8,117.43) v1(76.8,112.35) v1(76.8,107.27) v1(76.8,102.19) v1(76.8,97.11) v1(76.8,92.03) v1(76.8,86.95) v1(76.8,81.87) v1(76.8,76.79) v1(76.8,71.71) v1(76.8,66.63) v1(76.8,61.55) v1(76.8,56.47) v1(76.8,51.39) v1(76.8,46.31) v1(76.8,41.23) v1(76.8,36.15) v1(76.8,31.07) v1(76.8,25.99) v1(76.8,20.91) v1(76.8,15.83) v1(76.8,5.67) v1(78.36,8.11) v1(81.78,107.17) v1(81.78,106.28) v1(81.78,102.09) v1(81.78,101.2) v1(81.78,18.79) v1(81.78,17.9) v1(81.84,12.69) v1(81.84,10.15) v1(81.78,6.09) v1(81.78,5.2) v1(81.88,117.43) v1(81.88,97.11) v1(81.88,92.03) v1(81.88,86.95) v1(81.88,81.87) v1(81.88,76.79) v1(81.88,71.71) v1(81.88,66.63) v1(81.88,61.55) v1(81.88,56.47) v1(81.88,51.39) v1(81.88,46.31) v1(81.88,41.23) v1(81.88,36.15) v1(81.88,31.07) v1(81.88,25.99) v1(81.88,20.91) v1(81.86,13.98) v1(81.89,7.5) v1(85.83,8.88) v1(86.87,13.75) v1(86.94,10.09) v1(86.96,117.43) v1(86.96,97.11) v1(86.96,92.03) v1(86.96,86.95) v1(86.96,81.87) v1(86.96,76.79) v1(86.96,71.71) v1(86.96,66.63) v1(86.96,61.55) v1(86.96,56.47) v1(86.96,51.39) v1(86.96,46.31) v1(86.96,41.23) v1(86.96,36.15) v1(86.96,31.07) v1(86.96,25.99) v1(86.96,20.91) v1(86.97,7.53) v1(89.22,107.18) v1(89.22,106.29) v1(89.22,102.1) v1(89.22,101.21) v1(89.22,18.8) v1(89.22,17.91) v1(89.22,6.1) v1(89.22,5.21) v1(89.92,13.45) v1(91.87,12) v1(92.04,117.43) v1(92.04,112.35) v1(92.04,107.27) v1(92.04,102.19) v1(92.04,97.11) v1(92.04,92.03) v1(92.04,86.95) v1(92.04,81.87) v1(92.04,76.79) v1(92.04,71.71) v1(92.04,66.63) v1(92.04,61.55) v1(92.04,56.47) v1(92.04,51.39) v1(92.04,46.31) v1(92.04,41.23) v1(92.04,36.15) v1(92.04,31.07) v1(92.04,25.99) v1(92.04,20.91) v1(92.04,15.83) v1(92.04,5.67) v1(93.98,10.78) v1(96.52,9.51) v1(97.12,117.43) v1(97.12,112.35) v1(97.12,107.27) v1(97.12,102.19) v1(97.12,97.11) v1(97.12,92.03) v1(97.12,86.95) v1(97.12,81.87) v1(97.12,76.79) v1(97.12,71.71) v1(97.12,66.63) v1(97.12,61.55) v1(97.12,56.47) v1(97.12,51.39) v1(97.12,46.31) v1(97.12,41.23) v1(97.12,36.15) v1(97.12,31.07) v1(97.12,25.99) v1(97.12,20.91) v1(97.12,15.83) v1(97.12,5.67) v1(99.31,8.24) v1(101.73,10.17) v1(101.78,18.79) v1(101.78,17.9) v1(101.8,13.93) v1(101.78,6.09) v1(101.78,5.2) v1(102.2,117.43) v1(102.2,97.11) v1(102.2,92.03) v1(102.2,86.95) v1(102.2,81.87) v1(102.2,76.79) v1(102.2,71.71) v1(102.2,66.63) v1(102.2,61.55) v1(102.2,56.47) v1(102.2,51.39) v1(102.2,46.31) v1(102.2,41.23) v1(102.2,36.15) v1(102.2,31.07) v1(102.2,25.99) v1(102.2,20.91) v1(104.14,107.18) v1(104.14,106.29) v1(104.14,102.1) v1(104.14,101.21) v1(104.06,7.48) v1(106.55,13.32) v1(107.28,117.43) v1(107.28,97.11) v1(107.28,92.03) v1(107.28,86.95) v1(107.28,81.87) v1(107.28,76.79) v1(107.28,71.71) v1(107.28,66.63) v1(107.28,61.55) v1(107.28,56.47) v1(107.28,51.39) v1(107.28,46.31) v1(107.28,41.23) v1(107.28,36.15) v1(107.28,31.07) v1(107.28,25.99) v1(107.28,20.91) v1(109.22,107.18) v1(109.22,106.29) v1(109.22,102.1) v1(109.22,101.21) v1(109.22,18.8) v1(109.22,17.91) v1(109.19,11.34) v1(109.22,6.1) v1(109.22,5.21) v1(109.27,10.09) v1(109.32,8.85) v1(109.27,7.5) v1(112.36,117.43) v1(112.36,112.35) v1(112.36,107.27) v1(112.36,102.19) v1(112.36,97.11) v1(112.36,92.03) v1(112.36,86.95) v1(112.36,81.87) v1(112.36,76.79) v1(112.36,71.71) v1(112.36,66.63) v1(112.36,61.55) v1(112.36,56.47) v1(112.36,51.39) v1(112.36,46.31) v1(112.36,41.23) v1(112.36,36.15) v1(112.36,31.07) v1(112.36,25.99) v1(117.44,112.35) v1(117.44,107.27) v1(117.44,102.19) v1(117.44,97.11) v1(117.44,92.03) v1(117.44,86.95) v1(117.44,81.87) v1(117.44,76.79) v1(117.44,71.71) v1(117.44,66.63) v1(117.44,61.55) v1(117.44,56.47) v1(117.44,51.39) v1(117.44,46.31) v1(117.44,41.23) v1(117.44,36.15) v1(117.44,31.07) v1(117.44,25.99) v1(117.44,20.91) v1(117.44,15.83) v1(117.44,10.75) v1(117.44,5.67)
VBAT: length 178.1
  Top Layer w0.254: U9.7 28.07,114.38 28.07,115.56 27.31,116.32 21.34,116.32 20.26,115.24 U11.1 U11.2 20.32,54.99 TP13.1
  Bottom Layer w0.254: U19.7 106.71,113.02 99.95,113.02 98.61,114.35 U21.7 85.54,114.35 84.33,113.14 72.14,113.14 70.93,114.35 U17.7 65.47,114.35 64.13,113.02 60.2,113.02 58.86,114.35 U10.7 45.02,114.35 43.74,113.07 40.34,113.07 39.05,114.35 U9.7 24.83,114.35 23.52,113.04 20.17,113.04 18.86,114.35 U8.7
VDDA: length 169.9
  Top Layer w0.254: C5.2 33.93,61.41 L2.2 30.96,61.22 TP6.1
  Top Layer w0.5: v1(33.93,113.02) C20.1 33.93,79.08 34.5,78.51 U15.8 34.5,76.35 36.07,74.79 39.24,74.79 40,74.03 40,63.1 39.5,62.6 36.34,62.6 35.45,61.71 C5.2
  Bottom Layer w0.254: U10.5 45.15,111.81 46.35,113.02 53.47,113.02 54.74,111.75 62.9,111.75 U17.5 65.09,111.81 66.29,113.02 69.6,113.02 70.87,111.75 82.9,111.75 U21.5 85.28,111.81 86.49,113.02 94.49,113.02 95.76,111.75 102.9,111.75 U19.5 ; U8.5 4.51,111.81 5.79,113.09 16.81,113.09 18.16,111.75 22.89,111.75 U9.5
  Bottom Layer w0.4: U9.5 25.21,111.81 26.42,113.02 v1(33.93,113.02) 36.58,113.02 37.78,111.81 U10.5
I2C_SCL: length 110.6
  Top Layer w0.254: TP14.1 112.54,8.19 U18.11
  Bottom Layer w0.254: U12.11 19.13,8.19 20.32,9.38 23.75,9.38 24.89,8.24 U13.11 39.88,8.24 41.1,9.46 43.49,9.46 44.75,8.19 U14.11 58.75,8.19 60.02,9.46 63.81,9.46 65.07,8.19 U16.11 76.66,8.19 77.98,9.51 83.44,9.51 84.76,8.19 U20.11 97.23,8.19 98.55,9.51 104.78,9.51 106.09,8.19 U18.11
I2C_SDA: length 111.7
  Top Layer w0.254: U18.10 110.21,10.73 TP15.1
  Bottom Layer w0.254: U12.10 14.43,10.73 15.75,12.05 25.27,12.05 26.54,10.78 U13.10 36.7,10.78 37.92,12 45.26,12 46.53,10.73 U14.10 54.29,10.73 55.56,12 65.33,12 66.6,10.73 U16.10 72.34,10.73 73.66,12.05 84.96,12.05 86.28,10.73 U20.10 92.28,10.73 93.6,12.05 105.03,12.05 106.35,10.73 U18.10
SMB_ALERT: length 144.4
  Top Layer w0.254: TP9.1 113.17,15.87 109.22,11.92 106.43,11.92 105.08,13.27 U18.4
  Bottom Layer w0.254: U18.4 91.52,13.27 90.17,11.92 87.5,11.92 86.16,13.27 U20.4 82.91,13.32 71.75,13.32 70.49,12.05 67.44,12.05 66.22,13.27 U16.4 53.16,13.27 51.82,11.92 47.5,11.92 46.15,13.27 U14.4 42.88,13.19 35.94,13.19 34.77,12.02 27.46,12.02 26.16,13.32 U13.4 13.84,13.32 12.5,11.97 4.26,11.97 U12.4 3.12,13.27 5.21,15.35 5.21,30.47 6.74,32 U3.8
SMB_CLK: length 163.3
  Top Layer w0.254: TP10.1 110.83,6.84 106.43,6.84 105.08,8.19 U18.2
  Bottom Layer w0.254: U3.1 14,39.32 13.46,39.86 3.17,39.86 1.52,38.21 1.52,9 2.34,8.19 U12.2 4.21,6.94 21.66,6.94 U13.2 24.2,7 42.06,7 42.96,7.89 ; U18.2 102.91,8.24 101.47,8.24 100.08,6.84 84.58,6.84 83.24,8.19 U20.2 82.88,8.11 80.14,8.11 78.87,6.84 64.31,6.84 U16.2 62.96,7.57 62.23,6.84 43.94,6.84 42.96,7.82 42.96,7.89 ; 42.96,7.89 U14.2
SMB_DATA: length 151.1
  Top Layer w0.254: U12.3 3,10.73 4.32,12.05 4.83,12.05 v1(5.59,12.81) ; U18.3 104.95,10.73 106.22,9.46 112,9.46 TP11.1
  Bottom Layer w0.254: U12.3 4.26,9.43 16.56,9.43 17.91,10.78 U13.3 24.64,10.78 25.88,9.54 38.51,9.54 39.7,10.73 U14.3 44.63,10.73 45.97,9.38 56.64,9.38 58.04,10.78 62.91,10.78 U16.3 64.69,10.73 66.04,9.38 74.29,9.38 75.69,10.78 82.91,10.78 U20.3 84.12,10.73 85.34,9.51 94.62,9.51 95.88,10.78 102.91,10.78 U18.3 ; v1(5.59,12.81) 5.59,13.96 6.22,14.59 6.22,19.03 9.91,22.72 13.59,22.72 17.14,26.27 17.14,33.39 16.53,34 U3.5
STACK_ENABLE: length 163.9
  Top Layer w0.254: SW1.3 37.08,38.43 v1(37.08,37.2) ; U18.9 108.53,13.27 110.74,15.48 110.74,17.64 112.91,19.8 TP8.1
  Bottom Layer w0.254: 88.04,13.98 U20.9 ; 88.04,13.98 88.04,14.05 87.5,14.59 69.36,14.59 U16.9 68.04,13.73 67.23,14.54 48.8,14.54 48.04,13.78 ; 88.04,13.98 88.65,14.59 106.72,14.59 U18.9 ; 48.04,13.78 48.04,13.79 47.32,14.51 33.71,14.51 32.51,13.32 U13.9 26.77,14.59 18.16,14.59 ; 48.04,13.78 U14.9 ; 18.16,14.59 18.16,34.91 18.08,34.99 ; 18.16,14.59 10.8,14.59 9.47,13.27 U12.9 ; U3.4 13.01,34.99 18.08,34.99 ; v1(37.08,37.2) 37.08,35.8 36.27,34.99 18.08,34.99
VOCM: length 148
  Top Layer w0.254: TP3.1 31.69,74.92 C21.1 ; C21.1 R5.2 ; C21.1 31.98,75.83 31.37,76.44 31.37,110.09 29.65,111.81 U9.8
  Bottom Layer w0.254: U19.8 106.83,110.6 89.41,110.6 88.2,111.81 U21.8 86.83,110.6 69.25,110.6 U17.8 66.83,110.6 50.67,110.6 49.47,111.81 U10.8 47.68,111.81 46.35,110.47 35.31,110.47 34.42,111.36 28.49,111.36 U9.8 26.81,110.58 15.77,110.58 14.54,111.81 U8.8
VREF: length 168.4
  Top Layer w0.254: U5.5 U5.6 34.57,67.89 C9.1 ; C9.1 32.81,68.02 30.91,69.92 ; C9.1 33.4,69.31 33.4,70.02 R3.1 ; 30.91,69.92 29.84,70.98 29.84,109.2 28.5,110.55 26.73,110.55 25.53,111.75 25.53,113.02 24.19,114.35 U9.6 ; 30.91,69.92 30.91,69.88 TP1.1
  Bottom Layer w0.254: U19.6 101.25,116.06 84.67,116.06 U21.6 81.25,116.06 65.02,116.06 63.31,114.35 U17.6 61.25,116.06 44.67,116.06 U10.6 41.25,116.06 24.67,116.06 U9.6 21.25,116.06 4.67,116.06 U8.6
$1N832: length 12.3
  Top Layer w0.254: v1(35.01,51.46) 35.88,51.46 U2.8 ; R2.1 36.66,56.94 38.67,56.94 39.37,56.25 39.37,52.94 38.86,52.44 v1(38.86,52.35)
  Bottom Layer w0.254: v1(35.01,51.46) 35.91,52.35 v1(38.86,52.35)
$1N837: length 17.7
  Top Layer w0.203: 36.98,49.54 37,49.52 37,49.11 37.24,48.87 38.11,48.87 v1(38.86,48.12) ; 37.55,42.19 37.36,42.19 C6.1
  Top Layer w0.254: 35.22,42.12 33.29,42.12 R1.1 30.93,42.07 TP7.1 ; 35.22,42.12 C6.1 ; 35.22,42.12 35.27,42.08 SW1.2 ; v1(38.86,42.78) 38.27,42.19 37.55,42.19
  Bottom Layer w0.254: v1(38.86,48.12) v1(38.86,42.78)
$1N8820: length 2.2
  Top Layer w0.254: C8.1 33.76,64.27 34.29,63.74 34.34,63.79 34.6,63.79
$1N10873: length 8
  Top Layer w0.203: R3.2 33.82,71.11 31.62,71.11 TP4.1
  Top Layer w0.254: R3.2 R4.1 36.54,70.48 37.04,70.98 U15.3
$1N12732: length 3.3
  Top Layer w0.254: U15.2 U15.1 34.2,72.47 R5.1

## Copper pours and planes (outline as drawn; the poured copper is in the pictures)
+3V3 on Top Layer: 32.2,57.73 35.51,57.73 35.51,51.12 32.2,51.12
+3V3 on Top Layer: 23.95,109.78 26.87,109.78 26.87,108.76 23.95,108.76
+5V on Top Layer: 36.27,49.8 38.17,49.8 38.17,44.67 36.27,44.67
GND on Top Layer: -4.44,122.54 121.54,122.54 121.54,-4.46 -4.44,-4.46
GND on Top Layer: 37.4,51.81 38.56,51.81 38.56,49.27 37.4,49.27
GND on Top Layer: 32.2,50.95 36.02,50.95 36.02,44.8 32.2,44.8
GND on Bottom Layer: -4.7,122.67 103.63,122.67 103.63,-2.68 -4.7,-2.68
GND on Bottom Layer: -4.32,122.29 121.92,122.29 121.92,-3.32 -4.32,-3.32
GND on Inner1: -1.52,121.27 121.54,121.27 121.54,-1.41 -1.52,-1.41
GND on Inner2: -2.41,121.65 121.92,121.65 121.92,-1.41 -2.41,-1.41
$1N831 on Top Layer: 36.27,55.7 37.67,55.7 37.67,51.68 36.27,51.68

Small or netless copper shapes (teardrops, artwork), in the pictures only: 128 on Top Layer, 156 on Bottom Layer

## Text on the board
Bottom Silkscreen Layer: COMPUTE BASE BOARD 5X V101 | SEMANTIC BOAT PROJECT
Top Silkscreen Layer: VREF | VOCM | VDDA | VBAT | 3V3 | +5V | SEN | SAL | SDT | ICL | SCL | IDT | ON | SE
